# EasyEDA Pro project CCD传感器驱动板_DAC8311_ADS1118.eprj, board PCB1
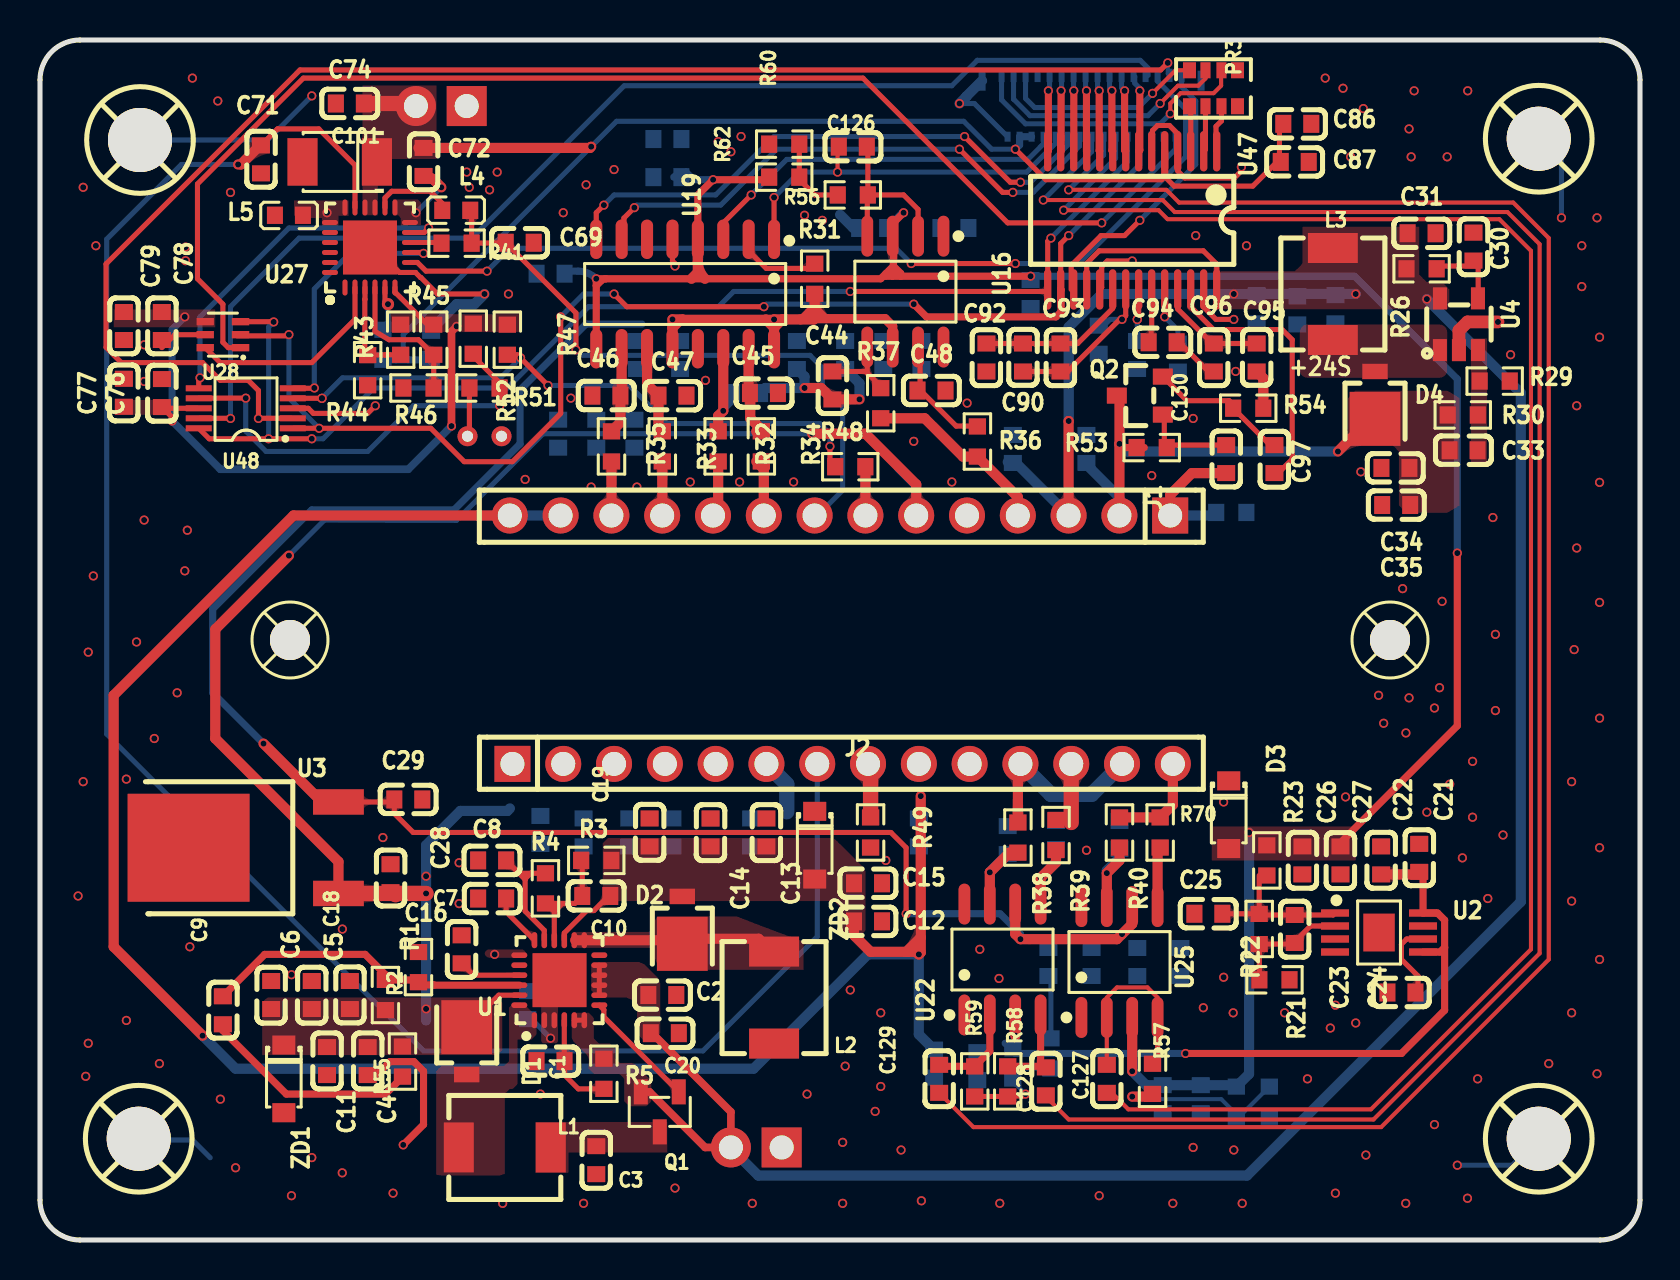
[diagram p2: board, top side]
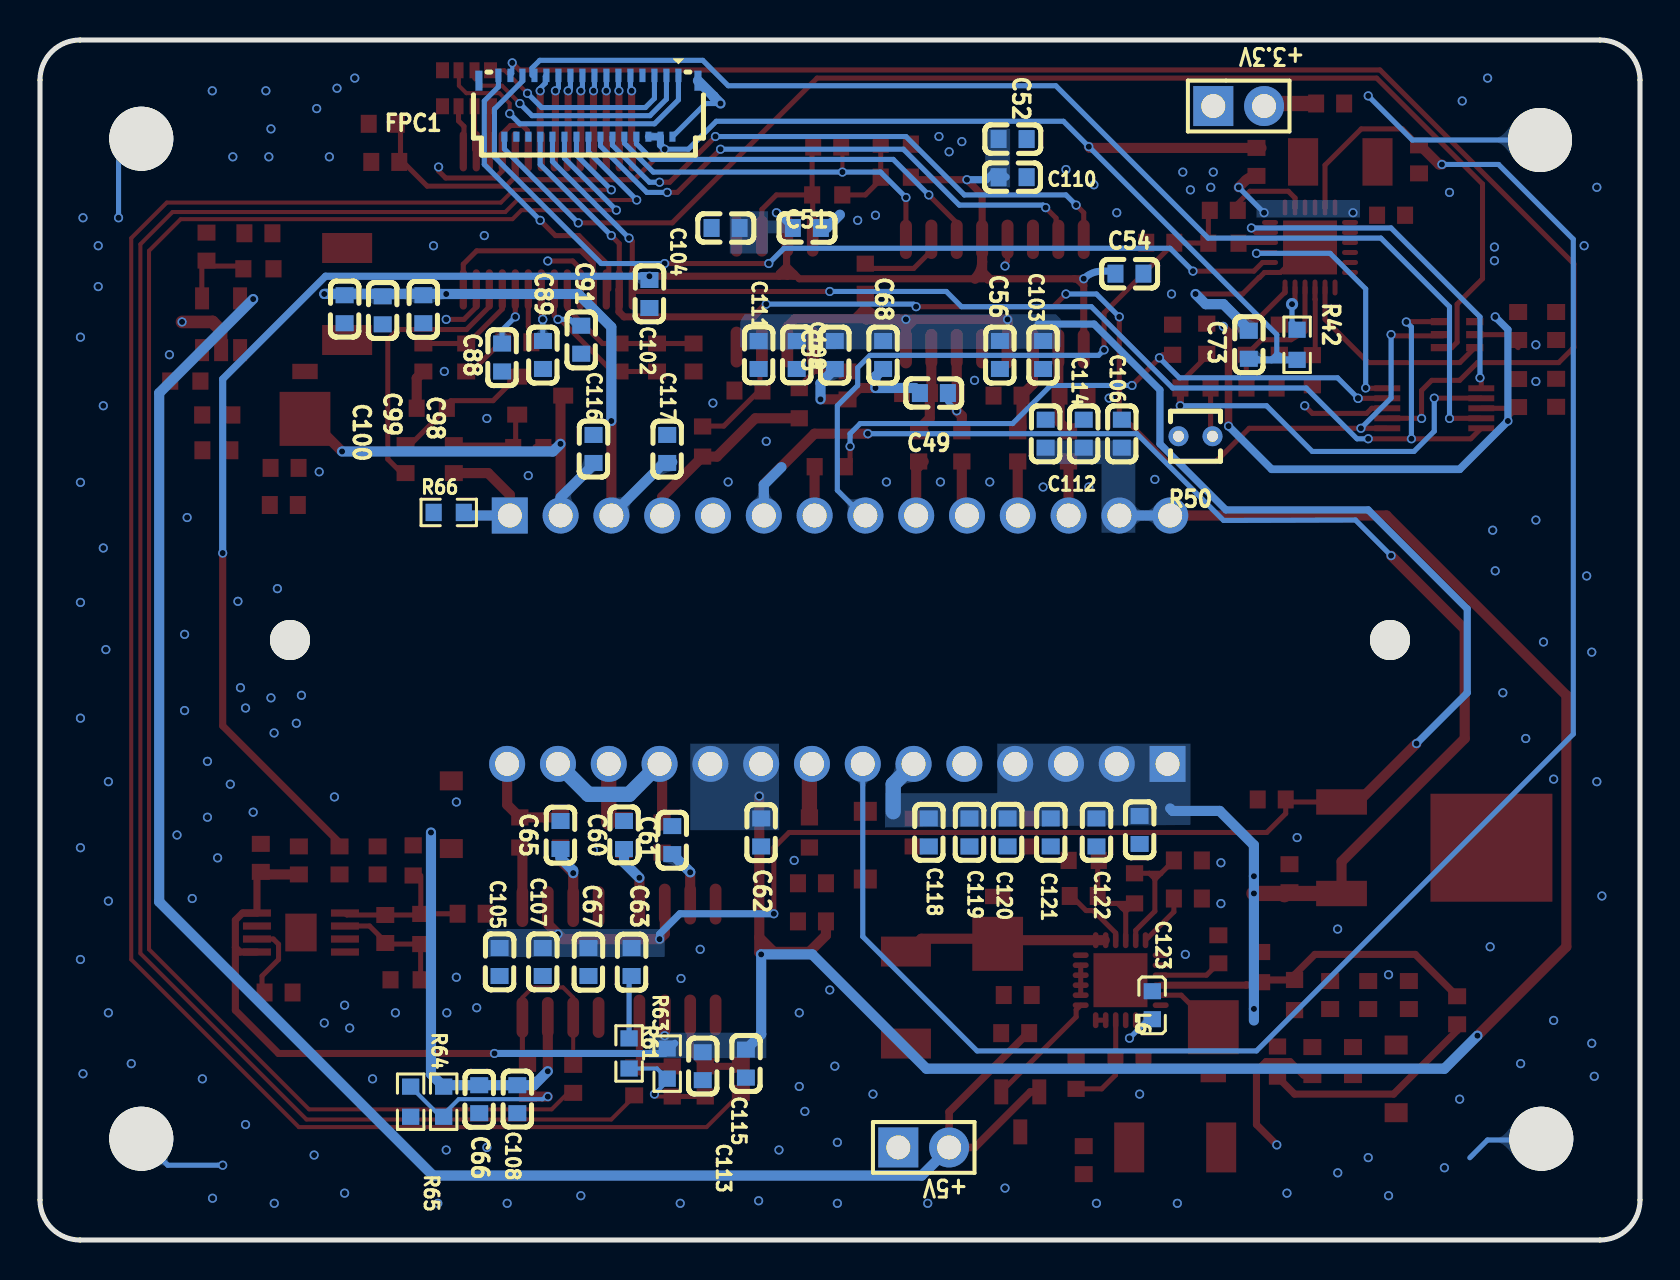
[diagram p3: board, bottom side, seen from below]

Outline 80 x 60 mm; copper layers: Top Layer, Inner1, Inner2, Bottom Layer. Coordinates in mm from the lower left corner of the outline.
Outline path: 0,58 0,2 arc(0.59,0.59) 2,0 78,0 arc(79.41,0.59) 80,2 80,58 arc(79.41,59.41) 78,60 2,60 arc(0.59,59.41) 0,58
Stack: Top Layer 0.035mm 外层铜厚1oz / Dielectric1 0.2104mm 7628 RC49% 8.6mil / Inner1 0.0152mm 内层铜厚 / Dielectric2 1.065mm 1.1mm H/HOZ 含铜 / Inner2 0.0152mm 内层铜厚 / Dielectric3 0.2104mm 7628 RC49% 8.6mil / Bottom Layer 0.035mm 外层铜厚1oz

## Design rules (mm)
template: 自定义配置
spacing copperThickness1oz (default): track to track 0.152, other pairs 0.152 to 0.3
spacing copperThickness2oz: track to track 0.203, other pairs 0.152 to 0.3
track width copperThickness1oz (default): min 0.127, default 0.254, max 2.54
track width copperThickness2oz: min 0.203, default 0.254, max 2.54
differential pair differentialPair (default): width min 0.127, default 0.254, max 2.54; gap min 0.152, default 0.152
via viaSize (default): diameter min 0.457, default 0.457, max 10; hole min 0.3, default 0.305, max 6.299

## Placement (name value [footprint] x y rotation side)
C1  100nF  [C0603]  25.53 8.95 180 top
C2  4.7uF  [C0603]  31.12 12.25 180 top
C3  4.7uF  [C0603]  27.81 3.99 90 top
C4  4.7uF  [C0603]  16.38 8.95 270 top
C5  4.7uF  [C0603]  13.59 12.25 90 top
C6  4.7uF  [C0603]  11.56 12.25 90 top
C7  4.7nF  [C0603]  22.61 17.07 180 top
C8  220nF  [C0603]  22.61 18.98 0 top
C9  15pF  [C0603]  9.14 11.49 270 top
C10  22pF  [C0603]  27.81 17.2 0 top
C11  4.7uF  [C0603]  14.35 8.95 270 top
C12  4.7uF  [C0603]  41.4 15.93 0 top
C13  4.7uF  [C0603]  36.32 20.38 90 top
C14  4.7uF  [C0603]  33.53 20.38 90 top
C15  4.7uF  [C0603]  41.4 17.84 0 top
C16  10nF  [C0603]  21.08 14.53 90 top
C18  100nF  [C0603]  15.49 12.25 270 top
C19  100nF  [C0603]  30.48 20.38 270 top
C20  100nF  [C0603]  31.24 10.34 180 top
C21  10uF  [C0603]  68.96 19.11 270 top
C22  100nF  [C0603]  67.06 18.98 270 top
C23  10nF  [C0603]  62.74 15.55 90 top
C24  10nF  [C0603]  68.07 12.38 0 top
C25  10uF  [C0603]  58.42 16.31 0 top
C26  4.7uF  [C0603]  63.12 18.98 270 top
C27  100nF  [C0603]  65.02 18.98 90 top
C28  330nF  [C0603]  17.53 18.09 270 top
C29  100nF  [C0603]  18.41 22.03 0 top
C30  220nF  [C0603]  71.68 49.67 90 top
C31  4.7uF  [C0603]  69.08 50.34 180 top
C33  10pF  [C0603]  71.18 39.49 0 top
C34  22uF  [C0603]  67.77 38.6 0 top
C35  10nF  [C0603]  67.81 36.75 180 top
C44  1nF  [C0603]  39.62 42.73 90 top
C45  1nF  [C0603]  36.19 42.35 180 top
C46  1nF  [C0603]  28.32 42.22 0 top
C47  1nF  [C0603]  31.62 42.22 180 top
C48  1nF  [C0603]  44.58 42.47 0 top
C49  1nF  [C0603]  35.31 42.35 180 bottom
C51  100nF  [C0603]  41.66 50.6 0 bottom
C52  100nF  [C0603]  31.37 55.05 0 bottom
C54  100nF  [C0603]  25.53 48.32 0 bottom
C55  100nF  [C0603]  40.26 44.25 90 bottom
C56  100nF  [C0603]  32 44.25 90 bottom
C60  1nF  [C0603]  50.8 20.25 270 bottom
C61  1nF  [C0603]  48.39 20 90 bottom
C62  100nF  [C0603]  43.94 20.38 90 bottom
C63  100nF  [C0603]  50.42 13.9 90 bottom
C65  1nF  [C0603]  53.97 20.25 90 bottom
C66  100nF  [C0603]  58.04 7.04 90 bottom
C67  100nF  [C0603]  52.58 13.9 90 bottom
C68  100nF  [C0603]  37.85 44.25 90 bottom
C69  10uF  [C0603]  23.99 49.86 0 top
C71  100nF  [C0603]  11.05 54.03 270 top
C72  10uF  [C0603]  19.18 53.9 270 top
C73  100nF  [C0603]  19.56 44.76 270 bottom
C74  100nF  [C0603]  15.49 56.83 0 top
C76  100nF  [C0603]  6.1 42.35 90 top
C77  10uF  [C0603]  4.19 42.36 90 top
C78  100nF  [C0603]  6.09 45.7 270 top
C79  10uF  [C0603]  4.19 45.7 270 top
C86  100nF  [C0603]  62.87 55.81 180 top
C87  4.7uF  [C0603]  62.74 53.9 0 top
C88  100nF  [C0603]  56.9 44.12 90 bottom
C89  100nF  [C0603]  54.85 44.25 90 bottom
C90  100nF  [C0603]  49.15 44.12 270 top
C91  100nF  [C0603]  52.94 45.01 90 bottom
C92  100nF  [C0603]  47.32 44.12 90 top
C93  10uF  [C0603]  51.02 44.12 90 top
C94  100nF  [C0603]  56.13 44.89 180 top
C95  100nF  [C0603]  60.83 44.12 270 top
C96  100nF  [C0603]  58.69 44.12 90 top
C97  100nF  [C0603]  61.72 39.05 90 top
C98  100nF  [C0603]  60.83 46.54 90 bottom
C99  100nF  [C0603]  62.87 46.48 90 bottom
C100  4.7uF  [C0603]  64.77 46.54 270 bottom
C101  100uF  [CASE-B_3528]  14.99 53.9 180 top
C102  4.7uF  [C0603]  49.53 47.3 270 bottom
C103  4.7uF  [C0603]  29.84 44.25 90 bottom
C104  4.7uF  [C0603]  45.72 50.6 0 bottom
C105  4.7uF  [C0603]  57.02 13.9 270 bottom
C106  4.7uF  [C0603]  25.91 40.31 90 bottom
C107  4.7uF  [C0603]  54.86 13.9 270 bottom
C108  4.7uF  [C0603]  56.13 7.04 270 bottom
C109  4.7uF  [C0603]  42.16 44.25 270 bottom
C110  4.7uF  [C0603]  31.37 53.14 180 bottom
C111  4.7uF  [C0603]  44.07 44.25 270 bottom
C112  4.7uF  [C0603]  29.72 40.31 90 bottom
C113  4.7uF  [C0603]  46.86 8.69 270 bottom
C114  4.7uF  [C0603]  27.81 40.31 90 bottom
C115  4.7uF  [C0603]  44.7 8.82 270 bottom
C116  4.7uF  [C0603]  52.32 39.55 90 bottom
C117  4.7uF  [C0603]  48.64 39.55 90 bottom
C118  4.7uF  [C0603]  35.56 20.38 270 bottom
C119  4.7uF  [C0603]  33.53 20.38 270 bottom
C120  4.7uF  [C0603]  31.62 20.38 270 bottom
C121  4.7uF  [C0603]  29.46 20.38 270 bottom
C122  4.7uF  [C0603]  27.18 20.38 270 bottom
C123  4.7uF  [C0603]  25.02 20.5 270 bottom
C126  100nF  [C0603]  40.64 54.67 180 top
C127  100nF  [C0603]  53.34 8.06 270 top
C128  100nF  [C0603]  50.29 7.93 270 top
C129  100nF  [C0603]  44.96 8.06 270 top
C130  100nF  [C0603]  59.31 39.05 270 top
D1  MBRM120ET1G  [POWERMITE_L2.0-W1.9-LS3.8-RD]  21.34 9.45 270 top
D2  MBRM120ET1G  [POWERMITE_L2.0-W1.9-LS3.8-RD]  32.12 15.99 90 top
D3  MMSZ5232B-7-F  [SOD-123_L2.8-W1.8-LS3.7-RD]  59.44 21.27 270 top
D4  MBRM120ET1G  [POWERMITE_L2.0-W1.9-LS3.8-RD]  66.75 42.24 90 top
FPC1  HC-FPC-03-09-31RLTAG  [FPC-SMD_31P-P0.30_HC-FPC-03-09-31RLTAG]  52.58 56.7 180 bottom
H1  PZ254V-11-02P  [HDR-TH_2P-P2.54-V-M]  35.81 4.63 180 bottom
H7  PZ254V-11-02P  [HDR-TH_2P-P2.54-V-M]  20.07 56.7 180 bottom
J1  PM254-1-14-Z-3.0-C  [HDR-TH_14P-P2.54-V-F]  40 36.22 180 top
J2  PM254-1-14-Z-3.0-C  [HDR-TH_14P-P2.54-V-F]  40.13 23.81 0 top
L1  4.7uH  [IND-SMD_L5.5-W5.2]  23.24 4.63 180 top
L2  4.7uH  [IND-SMD_L5.5-W5.2]  36.7 12.12 270 top
L3  4.7uH  [IND-SMD_L5.5-W5.2]  64.64 47.3 90 top
L4  1uH  [L0603]  20.81 51.48 0 top
L5  BLM18PG121SN1D  [L0603]  12.45 51.24 180 top
L6  BLM18PG121SN1D  [L0603]  24.38 11.74 90 bottom
PR3  22Ω  [RES-ARRAY-SMD_0603-8P-L3.2-W1.6-BL]  58.67 57.59 180 top
Q1  SI2323DS-T1-E3-MS  [SOT-23-3_L2.9-W1.3-P1.90-LS2.4-BR]  30.99 6.41 90 top
Q2  PMBT3904,215  [SOT-23_L2.9-W1.3-P1.90-LS2.4-BR]  54.99 42.22 0 top
R1  442kΩ  [R0603]  17.27 12.25 270 top
R2  56kΩ  [R0603]  18.92 13.64 270 top
R3  330kΩ  [R0603]  27.81 18.98 0 top
R4  49.9kΩ  [R0603]  25.27 17.58 90 top
R5  100Ω  [R0603]  28.19 8.31 270 top
R21  100kΩ  [R0603]  61.72 13.01 180 top
R22  324kΩ  [R0603]  60.96 15.55 90 top
R23  0Ω  [R0603]  61.34 18.98 90 top
R26  10kΩ  [R0603]  69.08 48.56 0 top
R29  10kΩ  [R0603]  72.73 42.95 0 top
R30  180kΩ  [R0603]  71.14 41.25 0 top
R31  10kΩ  [R0603]  38.74 48.06 270 top
R32  0Ω  [R0603]  33.91 39.68 270 top
R33  0Ω  [R0603]  31.12 39.68 270 top
R34  0Ω  [R0603]  36.07 39.68 270 top
R35  0Ω  [R0603]  28.57 39.68 270 top
R36  0Ω  [R0603]  46.87 39.92 270 top
R37  0Ω  [R0603]  42.04 41.84 270 top
R38  0Ω  [R0603]  48.9 20.12 90 top
R39  0Ω  [R0603]  50.8 20.25 90 top
R40  0Ω  [R0603]  53.97 20.38 90 top
R41  10Ω  [R0603]  20.83 49.84 180 top
R42  10Ω  [R0603]  17.14 44.76 90 bottom
R43  6.65kΩ  [R0603]  18.03 45.01 270 top
R44  10kΩ  [R0603]  16.38 43.49 270 top
R45  90.9kΩ  [R0603]  19.69 45.01 270 top
R46  37.4kΩ  [R0603]  18.92 42.6 0 top
R47  49.9kΩ  [R0603]  23.37 45.01 90 top
R48  25.5kΩ  [R0603]  40.51 38.66 0 top
R49  0Ω  [R0603]  41.53 20.38 90 top
R50  MF52A103F3950 (A1)  [RES-TH_L2.5-W2.5-P1.70-D0.3]  22.22 40.19 0 bottom
R51  25.5kΩ  [R0603]  22.22 42.6 180 top
R52  49.9kΩ  [R0603]  21.66 45.06 90 top
R53  110kΩ  [R0603]  55.59 39.62 180 top
R54  4kΩ  [R0603]  60.41 41.59 180 top
R55  51.1kΩ  [R0603]  18.12 8.92 90 top
R56  10kΩ  [R0603]  40.64 52.25 0 top
R57  10kΩ  [R0603]  55.63 8.06 90 top
R58  10kΩ  [R0603]  48.39 7.93 90 top
R59  10kΩ  [R0603]  46.74 7.93 90 top
R60  49.9kΩ  [R0603]  37.21 54.79 180 top
R61  49.9kΩ  [R0603]  50.55 9.33 90 bottom
R62  10kΩ  [R0603]  37.21 53.14 0 top
R63  10kΩ  [R0603]  48.64 8.82 270 bottom
R64  10kΩ  [R0603]  59.82 6.91 90 bottom
R65  10kΩ  [R0603]  61.47 6.91 90 bottom
R66  100kΩ  [R0603]  59.56 36.38 180 bottom
R70  0Ω  [R0603]  56.01 20.38 270 top
SCREW1  -  [M2螺丝]  12.5 30 0 top
SCREW2  -  [M2螺丝]  67.5 30 0 top
SCREW3  -  [M3螺丝]  75 55 0 top
SCREW4  -  [M3螺丝]  5.06 54.94 0 top
SCREW5  -  [M3螺丝]  5 5 0 top
SCREW6  -  [M3螺丝]  75 5 0 top
U1  TPS65131RGER  [QFN-24_L4.0-W4.0-P0.50-TL-EP2.6]  25.97 12.99 90 top
U2  TPS7A3001DGNR  [HVSSOP-8_L3.0-W3.0-P0.65-LS4.9-BL-EP_1]  66.95 15.37 270 top
U3  78M06  [TO-252-3_L6.5-W5.8-P4.58-BL]  11.18 19.61 90 top
U4  LT1935ES5#TRPBF  [TSOT-23-5_L2.9-W1.6-P0.95-LS2.8-BR]  70.95 45.79 270 top
U16  EL7202CSZ-T7  [SOIC-8_L4.9-W3.9-P1.27-LS6.0-BL]  43.27 47.42 180 top
U19  EL7457CSZ  [SOIC-16_L9.9-W3.9-P1.27-LS6.0-BL]  32.26 47.3 180 top
U22  EL7202CSZ-T7  [SOIC-8_L4.9-W3.9-P1.27-LS6.0-BL]  48.13 14.02 0 top
U25  EL7202CSZ-T7  [SOIC-8_L4.9-W3.9-P1.27-LS6.0-BL]  53.97 13.9 0 top
U27  ADN8833ACPZ-R2  [LFCSP-24_L4.0-W4.0-P0.50-BL-EP2.7]  16.5 49.63 0 top
U28  DAC8311IDCKR  [SC-70-6_L2.0-W1.3-P0.65-LS2.2-BL]  9.14 45.27 90 top
U47  AD9826KRSZRL  [SSOP-28_L10.2-W5.3-P0.65-LS7.8-BL]  54.61 50.98 180 top
U48  ADS1118IDGSR  [VSSOP-10_L3.0-W3.0-P0.50-LS4.9-BL]  10.29 41.58 90 top
ZD1  BZT52C15  [SOD-123_L2.8-W1.8-LS3.7-RD]  12.19 8.06 270 top
ZD2  BZT52C15  [SOD-123_L2.8-W1.8-LS3.7-RD]  38.74 19.74 270 top

## Footprints (pads in the part's own frame, mm; a bottom-side part is the same pattern mirrored in y, then rotated)
C0603
  rect 0.8x0.9 smd: 1(-0.7,0) 2(0.7,0)
CASE-B_3528
  rect 1.506x2.376 smd: 1(-1.861,0) 2(1.861,0)
FPC-SMD_31P-P0.30_HC-FPC-03-09-31RLTAG
  rect 0.3x0.67 smd: 1(4.5,1.532) 3(3.9,1.532) 5(3.3,1.532) 7(2.7,1.532) 9(2.1,1.532) 11(1.5,1.532) 13(0.9,1.532) 15(0.3,1.532) 17(-0.3,1.532) 19(-0.9,1.532) 21(-1.5,1.532) 23(-2.1,1.532) 25(-2.7,1.532) 27(-3.3,1.532) 29(-3.9,1.532) 31(-4.5,1.532)
  rect 0.3x0.5 smd: 2(4.2,-1.532) 4(3.6,-1.532) 6(3,-1.532) 8(2.4,-1.532) 10(1.8,-1.532) 12(1.2,-1.532) 14(0.6,-1.532) 16(0,-1.532) 18(-0.6,-1.532) 20(-1.2,-1.532) 22(-1.8,-1.532) 24(-2.4,-1.532) 26(-3,-1.532) 28(-3.6,-1.532) 30(-4.2,-1.532)
  rect 0.35x1 smd: 32(-5.475,1.268) 33(5.475,1.268)
HDR-TH_2P-P2.54-V-M
  rect 2x2 hole 1.2: 1(-1.27,0)
  round 2 hole 1.2: 2(1.27,0)
HDR-TH_14P-P2.54-V-F
  rect 1.8x1.8 hole 1.2: 1(-16.51,0)
  round 1.8 hole 1.2: 2(-13.97,0) 3(-11.43,0) 4(-8.89,0) 5(-6.35,0) 6(-3.81,0) 7(-1.27,0) 8(1.27,0) 9(3.81,0) 10(6.35,0) 11(8.89,0) 12(11.43,0) 13(13.97,0) 14(16.51,0)
HVSSOP-8_L3.0-W3.0-P0.65-LS4.9-BL-EP_1
  rect 0.364x1.4 smd: 1(-0.975,-2.2) 2(-0.325,-2.2) 3(0.325,-2.2) 4(0.975,-2.2) 5(0.975,2.2) 6(0.325,2.2) 7(-0.325,2.2) 8(-0.975,2.2)
  rect 1.89x1.57 smd: 9(0,0)
IND-SMD_L5.5-W5.2
  rect 1.5x2.5 smd: 1(-2.3,0) 2(2.3,0)
L0603
  rect 0.8x0.864 smd: 1(-0.7,0) 2(0.7,0)
LFCSP-24_L4.0-W4.0-P0.50-BL-EP2.7
  oval 0.25x0.8 smd: 1(-1.25,-2) 2(-0.75,-2) 3(-0.25,-2) 4(0.25,-2) 5(0.75,-2) 6(1.25,-2) 13(1.25,2) 14(0.75,2) 15(0.25,2) 16(-0.25,2) 17(-0.75,2) 18(-1.25,2)
  oval 0.8x0.25 smd: 7(2,-1.25) 8(2,-0.75) 9(2,-0.25) 10(2,0.25) 11(2,0.75) 12(2,1.25) 19(-2,1.25) 20(-2,0.75) 21(-2,0.25) 22(-2,-0.25) 23(-2,-0.75) 24(-2,-1.25)
  rect 2.7x2.7 smd: 25(0,0)
M2螺丝
  round 2 hole 2: 1(0,0)
M3螺丝
  round 3.2 hole 3.2: 1(-0.064,0.064)
POWERMITE_L2.0-W1.9-LS3.8-RD
  rect 2.7x2.54 smd: 1(-1.185,-0.001)
  rect 0.77x1.27 smd: 2(1.185,0.001)
QFN-24_L4.0-W4.0-P0.50-TL-EP2.6
  oval 0.8x0.28 smd: 1(-2,1.25) 2(-2,0.75) 3(-2,0.25) 4(-2,-0.25) 5(-2,-0.75) 6(-2,-1.25) 13(2,-1.25) 14(2,-0.75) 15(2,-0.25) 16(2,0.25) 17(2,0.75) 18(2,1.242)
  oval 0.28x0.8 smd: 7(-1.25,-2) 8(-0.75,-2) 9(-0.25,-2) 10(0.25,-2) 11(0.75,-2) 12(1.25,-2) 19(1.25,2) 20(0.75,2) 21(0.25,2) 22(-0.25,2) 23(-0.75,2) 24(-1.25,2)
  rect 2.7x2.7 smd: 25(0,-0.013)
R0603
  rect 0.806x0.864 smd: 1(-0.753,0) 2(0.753,0)
RES-ARRAY-SMD_0603-8P-L3.2-W1.6-BL
  rect 0.65x0.8 smd: 1(-1.2,-0.9) 4(1.2,-0.9) 5(1.2,0.9) 8(-1.2,0.9)
  rect 0.5x0.8 smd: 2(-0.4,-0.9) 3(0.4,-0.9) 6(0.4,0.9) 7(-0.4,0.9)
RES-TH_L2.5-W2.5-P1.70-D0.3
  round 1 hole 0.55: 1(-0.85,0) 2(0.85,0)
SC-70-6_L2.0-W1.3-P0.65-LS2.2-BL
  rect 0.364x0.866 smd: 1(-0.65,-0.883) 2(0,-0.883) 3(0.65,-0.883) 4(0.65,0.883) 5(0,0.883) 6(-0.65,0.883)
SOD-123_L2.8-W1.8-LS3.7-RD
  rect 0.95x1.15 smd: 1(-1.692,0) 2(1.692,0)
SOIC-8_L4.9-W3.9-P1.27-LS6.0-BL
  oval 0.588x2.045 smd: 1(-1.905,-2.772) 2(-0.635,-2.772) 3(0.635,-2.772) 4(1.905,-2.772) 5(1.905,2.772) 6(0.635,2.772) 7(-0.635,2.772) 8(-1.905,2.772)
SOIC-16_L9.9-W3.9-P1.27-LS6.0-BL
  oval 0.602x1.971 smd: 1(-4.445,-2.736) 2(-3.175,-2.736) 3(-1.905,-2.736) 4(-0.635,-2.736) 5(0.635,-2.736) 6(1.905,-2.736) 7(3.175,-2.736) 8(4.445,-2.736) 9(4.445,2.736) 10(3.175,2.736) 11(1.905,2.736) 12(0.635,2.736) 13(-0.635,2.736) 14(-1.905,2.736) 15(-3.175,2.736) 16(-4.445,2.736)
SOT-23-3_L2.9-W1.3-P1.90-LS2.4-BR
  rect 1.25x0.7 smd: 1(1,-0.95) 2(1,0.95) 3(-1,0)
SOT-23_L2.9-W1.3-P1.90-LS2.4-BR
  rect 1x0.8 smd: 1(1.15,-0.95) 2(1.15,0.95) 3(-1.15,0)
SSOP-28_L10.2-W5.3-P0.65-LS7.8-BL
  oval 0.364x2.015 smd: 1(-4.225,-3.455) 2(-3.575,-3.455) 3(-2.925,-3.455) 4(-2.275,-3.455) 5(-1.625,-3.455) 6(-0.975,-3.455) 7(-0.325,-3.455) 8(0.325,-3.455) 9(0.975,-3.455) 10(1.625,-3.455) 11(2.275,-3.455) 12(2.925,-3.455) 13(3.575,-3.455) 14(4.225,-3.455) 15(4.225,3.455) 16(3.575,3.455) 17(2.925,3.455) 18(2.275,3.455) 19(1.625,3.455) 20(0.975,3.455) 21(0.325,3.455) 22(-0.325,3.455) 23(-0.975,3.455) 24(-1.625,3.455) 25(-2.275,3.455) 26(-2.925,3.455) 27(-3.575,3.455) 28(-4.225,3.455)
TO-252-3_L6.5-W5.8-P4.58-BL
  rect 1.27x2.54 smd: 1(-2.288,-3.747) 3(2.288,-3.745)
  rect 5.4x6.1 smd: 2(-0.002,3.747)
TSOT-23-5_L2.9-W1.6-P0.95-LS2.8-BR
  rect 1.1x0.7 smd: 1(1.294,-0.951) 2(1.294,-0.001) 3(1.294,0.951) 4(-1.294,0.951) 5(-1.294,-0.949)
VSSOP-10_L3.0-W3.0-P0.50-LS4.9-BL
  rect 0.3x1.3 smd: 1(-1,-2.35) 2(-0.5,-2.35) 3(0,-2.35) 4(0.5,-2.35) 5(1,-2.35) 6(1,2.35) 7(0.5,2.35) 8(0,2.35) 9(-0.5,2.35) 10(-1,2.35)

## Nets
As in the schematic.

Pads without a net: FPC1 7 26 28; PR3 1 8; U1 12 20; U2 3 7; U16 1 8; U19 6 13; U22 1 8; U25 1 8; U27 1 20 21 22 23 24

## Via types
v1: diameter 0.457, hole 0.305, Top Layer to Bottom Layer, 275 vias
v2: diameter 0.61, hole 0.305, Top Layer to Bottom Layer, 1 via

## Routing (per net, layer and track width the routed paths; a pad name or vN(x,y) marks a point on that pad's centre or on a via; arc(x,y) is an arc through that point)
+3.3V: length 69.3
  Top Layer w0.254: 61.97,55.49 61.97,54.03 60.64,52.69 56.71,52.69 56.24,53.17 56.08,53.02 50.29,53.02 v1(48.77,54.54)
  Top Layer w0.355: U47.5 56.24,53.17
  Top Layer w0.508: 18.92,54.6 27.5,54.6 v1(27.56,54.67)
  Top Layer w0.762: 18.8,57.08 18.54,56.83 C74.2
  Bottom Layer w0.254: 18.16,44.26 18.16,45.27 v1(27.56,54.67) 28.83,55.94 46.18,55.94 47.58,54.54 v1(48.77,54.54)
  Bottom Layer w0.305: 18.41,44.01 18.16,44.26 arc(18.05,44.24) 17.95,44.17 17.79,44.01
  Bottom Layer w0.355: v1(48.77,54.54) 48.98,54.75 FPC1.4 FPC1.6 ; 19.18,44.06 19.18,44.01 17.4,44.01
+5V: length 131.6
  Top Layer w0.254: U47.18 52.34,48.83 52.96,49.46 58.17,49.46 58.84,48.79 U47.28 ; U1.8 U1.9 U1.10 U1.11 ; U1.6 U1.5
  Top Layer w0.381: 30.35,10.5 30.45,10.5 34.54,6.41 H1.2 33.26,4.63 30.48,7.41 Q1.2
  Top Layer w0.508: J1.3 51.43,40.94 v1(51.44,40.95)
  Bottom Layer w0.508: J1.3 48.76,38.9 48.39,38.9 ; v1(69.34,47.05) 74.04,42.35 74.04,16.91 60.35,3.22 35.92,3.22 34.38,4.75 34.42,4.75 ; v1(65.79,47.3) 65.78,47.31 60.46,47.31 60.46,47.3 v1(59.69,47.3) 53.09,47.3 51.44,45.65 v1(51.44,40.95)
+6V_D: length 109.7
  Top Layer w0.254: v1(43.31,16.31) 43.31,19.61 42.54,20.38 18.66,20.38 17.72,21.32 17.72,21.9 14.92,21.9 U3.3
  Top Layer w0.355: 39.32,46.07 38.93,46.46 arc(38.84,46.52) 38.74,46.54 arc(38.57,46.51) 38.42,46.41 38.04,46.03
  Top Layer w0.457: 32.12,46.03 v1(36.7,46.03) ; U16.6 42.63,45.69 42.25,46.07 38.74,46.07
  Top Layer w0.508: 31.62,45.61 U19.12 ; 31.62,45.61 31.98,45.97 arc(32.05,46.02) 32.12,46.03 v1(31.62,46.03) 31.62,45.61 ; 36.7,45.62 36.29,46.03 ; 36.7,45.62 37.11,46.03 ; 36.7,45.62 v1(36.7,46.03) 37.11,46.03 ; 36.7,45.62 U19.16 ; U22.6 48.76,15.3 v1(49.02,15.04) 53.85,15.04 v1(54.1,15.3) 54.61,15.8 54.61,16.8 ; R31.2 38.74,46.07 38.7,46.03 37.11,46.03 ; U3.3 14.09,21.9 v1(11.18,24.82)
  Bottom Layer w0.355: v1(11.18,24.82) 8.64,27.36 8.64,31.55 13.59,36.5 20.7,36.5 24,39.81 24,42.5 27.3,45.8 30.1,45.8 ; v1(49.02,15.04) 49.02,15.3 48.01,16.31 v1(43.31,16.31)
+12V_D: length 84.5
  Top Layer w0.254: U1.23 22.94,12.24 D1.1
  Top Layer w0.508: U3.1 14.92,18.92 8.76,25.08 8.76,30.54 v1(12.45,34.22) ; J1.6 43.81,37.78 41.28,40.31 v1(38.61,40.31)
  Top Layer w0.762: U3.1 17.84,17.33 17.78,17.26 ; v1(19.3,17.33) 17.84,17.33
  Bottom Layer w0.254: v1(12.45,34.22) 14.22,36 20.82,35.98 25.16,40.31 v1(38.61,40.31)
  Bottom Layer w0.508: 42.93,38.64 43.81,37.76 J1.6 ; 23.5,21.58 23.37,21.45 21.02,21.45 19.3,19.74 v1(19.3,18.19) v1(19.3,17.33) v1(19.3,11.56) 19.3,10.98
  Bottom Layer w0.762: 37.34,21.41 37.34,22.79 J2.6
+24V_D: length 24.8
  Top Layer w0.355: 55.21,39.62 54.16,39.62 v1(53.97,39.81)
  Top Layer w0.508: v1(64.9,39.43) 66.75,41.28 66.75,41.82 ; J1.2 53.97,39.8 v1(53.97,39.81) 53.97,42.09 Q2.3
  Bottom Layer w0.508: J1.2 53.97,37.12 52.32,38.77 ; v1(53.97,39.81) 54.36,39.43 v1(64.9,39.43)
-5V_D: length 115.5
  Top Layer w0.355: 42.29,48.32 42.29,48.19 42.63,48.19 ; 42.29,48.32 42.04,48.06 28.29,48.06 ; 42.29,48.32 42.67,48.7 ; 42.67,48.7 43.03,48.33 43.03,48.19 ; 42.67,48.7 42.67,50.15 U16.3 42.63,50.82 v1(43.18,51.36) ; 42.67,48.7 42.67,48.23 42.63,48.19 ; 43.03,48.19 42.63,48.19 ; 43.03,48.19 v1(49.53,48.19) ; v1(70.87,34.35) 70.87,25.71 64.84,19.68 64.77,19.68 ; 27.81,47.72 v1(27.81,48.06) 28.29,48.06 ; 27.81,47.72 27.81,44.56 ; 27.81,47.72 28.06,47.97 arc(28.17,48.04) 28.29,48.06 ; R62.1 36.33,53.02 v1(33.66,53.02) 32.89,52.25 U19.4
  Top Layer w0.508: 32.58,48.06 32.89,48.38 32.89,48.92 ; v1(54.61,8.44) U25.3 ; 32.89,48.92 U19.4 ; 32.89,48.92 arc(32.99,48.45) 33.25,48.06
  Bottom Layer w0.355: v1(70.87,34.35) 70.87,43.05 65.72,48.19 v1(49.53,48.19) ; v1(33.66,53.02) 32.68,53.02 32.3,53.4 arc(31.97,53.33) 31.69,53.14 ; C51.2 43.12,51.36 v1(43.18,51.36) ; 26.23,48.44 26.89,48.44 arc(27.39,48.34) v1(27.81,48.06)
  Bottom Layer w0.508: v1(60.45,20.38) 60.45,8.3 R64.2 59.74,7.74 C66.2 C108.1 55.31,7.74 v1(54.61,8.44)
-8V_D: length 140.6
  Top Layer w0.254: U1.15 26.22,15.35 27.34,16.47 27.7,16.47 28.43,17.2 C10.2
  Top Layer w0.355: 69.09,18.28 69.15,18.22 U2.8 69.88,16.35 70.23,15.99 70.23,14.63 ; v1(57.28,9.33) 68.07,9.33 70.23,11.49 70.23,14.63 ; 70.23,14.63 70,14.4 U2.5
  Top Layer w0.508: v1(8.13,10.22) 3.68,14.66 3.68,27.23 12.67,36.22 J1.14 ; U22.3 48.77,11.24 v1(48.77,10.22) ; 69.09,18.28 C22.2 ; 43.33,14.41 41.53,14.41 40.7,15.23 C12.1 ; 43.33,14.41 43.33,14.42 44.04,15.13 ; 43.33,14.41 43.81,14.41 v1(43.94,14.28) 44.04,14.38 44.04,15.13 ; 44.04,15.13 v1(44.04,22.19)
  Bottom Layer w0.355: v1(57.28,9.33) 48.77,9.33 48.26,9.84
  Bottom Layer w0.508: v1(8.13,10.22) 9.78,8.56 35.68,8.56 41.39,14.28 v1(43.94,14.28) 43.94,10.28 44.7,9.52 ; J1.14 J1.13
  vias: v1(23.16,36)
AGND: length 86.1
  Top Layer w0.254: 6.09,44.62 6.74,45.27 8.26,45.27 ; U47.6 55.63,54.48 55.63,55.47 55.88,55.73 56.47,55.73 56.88,55.31 56.88,53.46 57.24,53.1 59.72,53.1 60.07,53.46 v1(60.07,53.65) ; 31.75,48.82 31.62,48.95 U19.5 ; v1(59.69,46.03) 58.8,46.03 58.19,46.65 U47.27 ; v1(54.61,48.95) 53.37,48.95 53.09,48.67 53.09,47.63 U47.19 ; v1(22.22,47.3) 19.87,47.3 19.05,48.12 19.03,48.12 18.77,48.38 U27.7 17.97,48.38 16.72,49.63 U27.25 ; C96.1 58.42,43.42 56.96,44.89 ; U48.3 13.41,41.58 13.67,41.33 16.38,41.33 v1(16.76,41.71)
  Top Layer w0.355: v1(18.16,4.75) 19.18,5.77 19.18,8.44 18.7,8.92 17.5,8.92 16.83,8.25 C4.2
  Top Layer w0.508: v1(40.97,42.03) 39.63,42.03 C44.1 39.05,42.6 v1(38.23,42.6) ; C95.2 61.16,43.09 61.16,41.59
  Top Layer w0.635: 70.95,44.75 70.95,45.47 71.37,45.9 v1(72.9,45.9)
  Bottom Layer w0.254: v1(5,5) 7.62,5 8.51,4.11 ; C63.1 50.55,13.07 R61.2 ; v1(70.87,3.74) 73.61,3.74 SCREW6.1 ; v1(13.59,57.21) 11.38,55 SCREW4.1 ; v1(45.97,56.83) 46.72,56.83 FPC1.2 ; v1(76.07,51.11) 76.07,53.93 SCREW3.1
  Bottom Layer w0.508: v1(45.97,56.83) 46.32,57.17 46.32,57.18 FPC1.33 ; v1(22.22,47.3) 21.72,46.79 20.83,46.79 19.56,45.52 C73.1 ; v1(40.97,42.03) 40.97,42.84 C55.1 ; C51.1 40.67,50.6 40,51.27 ; C68.1 38.23,43.17 v1(38.23,42.6) 36.26,42.6 C49.1
  vias: v1(1.91,17.2) v1(2.16,52.63) v1(2.16,22.92) v1(2.29,8.18) v1(2.41,29.39) v1(2.41,9.84) v1(2.67,33.2) v1(2.79,49.71) v1(4.32,23.04) v1(4.32,10.98) v1(4.83,29.9) v1(5.21,44.76) v1(5.21,42.93) v1(5.21,36) v1(5.72,25.08) v1(5.97,8.82) v1(6.86,27.36) v1(7.24,33.46) v1(7.28,49.65) v1(7.28,48.96) v1(7.37,35.49) v1(7.49,14.66) v1(7.62,58.09) v1(8.89,56.95) v1(9.02,7.04) v1(9.53,52.38) v1(9.78,3.61) v1(12.57,13.26) v1(12.57,2.22) v1(13.59,4.12) v1(15.12,15.55) v1(15.11,3.36) v1(17.14,20.12) v1(17.65,2.34) v1(20.96,18.86) v1(20.96,16.82) v1(21.34,53.4) v1(21.46,52.63) v1(22.48,52.51) v1(22.73,14.28) v1(22.86,53.4) v1(23.13,1.83) v1(23.42,47.3) v1(24.26,38.03) v1(25.02,7.29) v1(26.16,51.36) v1(26.54,42.09) v1(27.18,1.83) v1(27.31,52.76) v1(27.56,37.65) v1(28.7,53.52) v1(29.84,37.65) v1(31.75,48.7) v1(31.75,2.6) v1(32.51,37.9) v1(33.27,42.98) v1(33.91,54.92) v1(34.54,54.41) v1(34.98,37.9) v1(35.05,55.17) v1(35.61,1.83) v1(37.68,37.9) v1(38.23,51.24) v1(38.35,7.29) v1(39.12,50.98) v1(40.13,4.88) v1(40.13,1.83) v1(40.26,8.69) v1(40.51,12.5) v1(41.76,6.43) v1(42.04,11.36) v1(42.04,7.68) v1(42.29,18.98) v1(43.05,4.5) v1(43.69,39.93) v1(44.07,1.96) v1(45.59,37.9) v1(46.35,41.85) v1(46.99,14.53) v1(47.95,13.08) v1(47.99,1.83) v1(52.32,19.49) v1(52.96,2.22) v1(55.59,38.22) v1(56.64,1.83) v1(57.66,41.08) v1(57.66,4.63) v1(57.78,50.22) v1(58.17,11.61) v1(59.18,21.9) v1(59.18,13.14) v1(59.66,11.36) v1(59.69,4.5) v1(59.78,43.43) v1(60.11,1.83) v1(60.32,49.71) v1(62.23,11.36) v1(63.37,8.06) v1(64.26,58.09) v1(64.52,10.6) v1(64.77,11.74) v1(64.77,2.34) v1(65.15,57.59) v1(65.28,22.15) v1(65.53,54.16) v1(65.79,10.85) v1(66.04,38.41) v1(66.17,56.57) v1(66.29,4.25) v1(66.93,27.23) v1(67.18,25.84) v1(68.13,32.57) v1(68.3,25.35) v1(68.29,1.83) v1(68.45,55.56) v1(68.45,27.11) v1(68.56,54.16) v1(68.71,57.46) v1(69.34,21.39) v1(69.72,26.6) v1(69.72,5.77) v1(69.98,27.61) v1(70.1,31.93) v1(70.36,54.16) v1(70.49,22.79) v1(71.12,19.11) v1(71.39,57.46) v1(71.37,2.09) v1(71.63,23.93) v1(71.63,21.14) v1(71.88,8.06) v1(72.39,17.07) v1(72.64,36.12) v1(72.77,30.28) v1(72.77,26.47) v1(73.15,20.25) v1(73.53,44.27) v1(75.44,8.82) v1(76.58,22.92) v1(76.58,16.95) v1(76.58,11.36) v1(76.71,29.52) v1(76.84,41.71) v1(76.84,34.6) v1(77.09,49.71) v1(77.09,47.67) v1(77.85,51.11) v1(77.85,8.31) v1(77.98,45.14) v1(77.98,37.88) v1(77.98,31.88) v1(77.98,26.09) v1(77.98,19.61) v1(77.98,14.03)
GND: length 4.7
  Top Layer w0.508: v1(20.07,52.63) 19.72,52.98 arc(19.47,53.15) C72.2
  Bottom Layer w0.254: v1(25.53,10.09) 24.58,11.04 24.13,11.04 ; v1(20.07,52.63) v1(18.8,51.36)
  vias: v1(14.35,51.36)
P1V: length 2.9
  Top Layer w0.762: 51.56,20.88 J2.12
P2V: length 9.3
  Top Layer w0.508: R38.2 48.9,23.68 J2.11
  Bottom Layer w0.762: J2.11 50.55,22.28 52.58,22.28 J2.13
AD_ADCCLK: length 2.3
  Top Layer w0.254: U47.3 57.53,56.63 PR3.5
AD_ADCCLK_I: length 10.3
  Top Layer w0.203: v1(55.63,57.33) 56.78,58.49 PR3.4
  Bottom Layer w0.254: v1(55.63,57.33) 54.91,56.62 49.73,56.62 49.28,57.08 FPC1.5
AD_CDSCLK1: length 2.4
  Top Layer w0.254: PR3.7 59.07,55.95 58.8,55.68 58.8,54.47 U47.1
AD_CDSCLK1_I: length 14.6
  Top Layer w0.203: v1(56.51,56.32) 56.51,56.83 57.03,57.34 58.68,57.34 59.06,57.71 59.06,58.47 PR3.2
  Bottom Layer w0.254: FPC1.1 48.08,57.01 49.28,55.81 56.01,55.81 v1(56.51,56.32)
AD_CDSCLK2: length 2.3
  Top Layer w0.254: PR3.6 58.27,54.53 U47.2
AD_CDSCLK2_I: length 12.3
  Top Layer w0.203: PR3.3 58.27,58.08 57.91,57.71 56.9,57.71 v1(56.01,56.83)
  Bottom Layer w0.254: v1(56.01,56.83) 55.4,56.22 49.5,56.22 48.68,57.04 FPC1.3
ADC0_CCD_TH: length 31.8
  Top Layer w0.254: R47.1 23.87,44.26 v1(25.4,42.73) ; U48.4 v1(14.1,42.08) ; R48.1 39.5,38.93 v1(39.5,39.68)
  Bottom Layer w0.254: v1(24.03,44.11) 23.03,43.11 15.12,43.11 v1(14.1,42.08) ; v1(39.5,39.68) 39.5,40.31 38.99,40.82 31.37,40.82 29.46,42.73 v1(25.4,42.73)
ADC1_VTEC: length 12.9
  Top Layer w0.254: v1(19.18,49.33) 19.13,49.38 U27.9 ; U48.5 13.7,42.58 v1(13.72,42.6)
  Bottom Layer w0.254: v1(13.72,42.6) 13.72,47.55 15.49,49.33 v1(19.18,49.33)
ADC2_ITEC: length 17.9
  Top Layer w0.254: v1(19.43,50.6) 19.2,50.38 U27.11 ; v1(8,43.11) 7.94,43.05 7.94,42.58
  Bottom Layer w0.254: v1(8,43.11) 8,46.16 12.45,50.6 v1(19.43,50.6)
ADC3_ENV: length 21.3
  Top Layer w0.254: 21.54,44.31 22.98,42.87 R51.1 ; v1(10.29,42.09) 7.94,42.09 7.94,42.08
  Top Layer w0.355: v1(22.99,41.71) 22.98,41.72 R51.1
  Bottom Layer w0.254: v1(10.29,42.09) 10.29,40.44 11.3,39.43 16.38,39.43 18.67,41.71 v1(22.99,41.71)
ADN8833_EN: length 46.6
  Top Layer w0.254: v1(48.77,48.82) v1(43.56,48.82) ; v1(22.35,48.44) 19.3,48.44 18.87,48.88 U27.8
  Bottom Layer w0.254: v1(22.35,48.44) 23.5,49.59 42.8,49.59 v1(43.56,48.82) ; FPC1.27 55.88,57.94 57.28,56.54 57.28,54.16 51.94,48.82 v1(48.77,48.82)
CAPB: length 8.3
  Top Layer w0.254: 53.63,47.78 53.63,46.58 51.88,44.83 C93.2 49.75,44.83 49.74,44.81 49.72,44.83 C90.1 C92.2
CAPT: length 8.9
  Top Layer w0.254: C90.2 C93.1 51.38,43.42 53.99,46.03 v1(54.1,46.03) 54.28,46.21 54.28,47.53
  Bottom Layer w0.254: C91.2 53.19,45.71 53.51,46.03 v1(54.1,46.03)
CCD_IN: length 14
  Top Layer w0.254: 57.53,47.78 57.53,46.66 58.67,45.52 62.1,45.52 62.61,45.01 62.61,39.04 61.82,38.25
CCD_P+: length 95.2
  Top Layer w0.254: U27.17 15.75,53.74 13.94,55.56 11.87,55.56 C71.1
  Top Layer w0.508: C71.1 11,54.73 10.05,53.78 v1(9.91,53.78)
  Bottom Layer w0.254: v1(9.91,53.78) 7.07,53.78 3.33,50.04 3.33,25.3 19.18,9.45 33.15,9.45 38.86,15.17 38.86,23.64
CCD_P-: length 30.9
  Top Layer w0.254: v1(26.8,44.51) 26.8,46.35 C69.1 R41.1 21.58,51.29 21.51,51.36
  Bottom Layer w0.254: v1(26.8,44.51) 27.07,44.23 38.5,44.23 39.12,43.62 39.12,42.73 40.13,41.71 40.13,37.48 39,36.35
CCD_TH1: length 2.2
  Top Layer w0.508: 41.27,38.41 J1.7
CCD_TH2: length 2.7
  Top Layer w0.762: J2.8 41.53,23.68 R49.2
CML: length 2.7
  Top Layer w0.254: U47.23 55.59,45.67 55.56,45.65 55.56,44.89
D0: length 3.8
  Top Layer w0.355: v1(50.42,57.46) 50.42,54.47 50.38,54.44
  Bottom Layer w0.254: FPC1.9 50.48,57.52 v1(50.42,57.46)
D1: length 3.8
  Top Layer w0.355: U47.13 51.05,54.46 v1(51.05,57.46)
  Bottom Layer w0.254: v1(51.05,57.46) 51.08,57.48 FPC1.11
D2: length 3.8
  Top Layer w0.355: v1(51.69,57.46) 51.69,54.44 U47.12
  Bottom Layer w0.254: FPC1.13 51.68,57.47 v1(51.69,57.46)
D3: length 3.8
  Top Layer w0.355: v1(52.32,57.46) 52.32,54.45 U47.11
  Bottom Layer w0.254: v1(52.32,57.46) 52.28,57.51 FPC1.15
D4: length 3.8
  Top Layer w0.355: U47.10 52.96,54.46 v1(52.96,57.46)
  Bottom Layer w0.254: FPC1.17 52.88,57.54 v1(52.96,57.46)
D5: length 3.9
  Top Layer w0.355: U47.9 53.59,54.48 v1(53.59,57.46)
  Bottom Layer w0.254: v1(53.59,57.46) 53.48,57.58 FPC1.19
D6: length 3.9
  Top Layer w0.355: v1(54.23,57.46) 54.23,54.49 54.28,54.44
  Bottom Layer w0.254: FPC1.21 54.08,57.61 v1(54.23,57.46)
D7: length 3.9
  Top Layer w0.355: v1(54.99,57.46) 54.99,54.49 U47.7
  Bottom Layer w0.254: v1(54.99,57.46) 54.99,57.59 54.74,57.84 54.74,58.17 FPC1.23
DAC0: length 10.3
  Top Layer w0.254: 8.26,44.62 9.01,43.87 13.59,43.87 15.75,46.03 U27.2
ILIM: length 7.2
  Top Layer w0.254: 19.68,44.26 18.92,45.01 17.45,45.01 16.75,45.43 U27.4 ; R45.2 19.69,42.61 R46.2
IP1H: length 28.6
  Top Layer w0.254: v1(28.19,51.75) 27.81,51.36 27.81,50.04 ; v1(46.23,55.17) 48.51,52.89 v1(49.02,52.89)
  Bottom Layer w0.254: v1(28.19,51.75) 28.7,52.25 33.78,52.25 36.7,55.17 v1(46.23,55.17) ; FPC1.12 51.38,54.74 49.53,52.89 v1(49.02,52.89)
IP1V: length 94.2
  Top Layer w0.203: 50.42,7.23 50.23,7.23 51.44,6.03 66.68,6.03 74.98,14.33 74.98,49.79 73.37,51.4 56.74,51.4 56.13,52 v1(50.16,52)
  Bottom Layer w0.254: v1(50.16,52) 52.58,54.41 FPC1.16
IP1V_8V: length 4.3
  Top Layer w0.355: 50.03,8.64 50.04,8.63 ; 50.03,8.64 49.98,8.68 R58.2 ; 50.03,8.64 U22.4
IP2H: length 27.3
  Top Layer w0.254: v1(29.72,51.62) 29.2,51.1 29.2,50.36 ; v1(48.64,52.38) 48.13,52.38 v1(45.97,54.54)
  Bottom Layer w0.254: v1(45.97,54.54) 36.83,54.54 34.04,51.75 29.84,51.75 v1(29.72,51.62) ; v1(48.64,52.38) 49.66,52.38 51.98,54.7 FPC1.14
IP2V: length 99.1
  Top Layer w0.203: C129.2 46.67,5.64 67.06,5.64 75.44,14.03 75.44,50.09 73.66,51.87 56.96,51.87 56.32,52.51 v1(51.44,52.51)
  Bottom Layer w0.254: v1(51.44,52.51) 53.18,54.25 FPC1.18
IP2V_8V: length 4.7
  Top Layer w0.355: U22.2 47.49,9.44 R59.2 45.01,8.68 44.96,8.63
IP3H: length 18.8
  Top Layer w0.254: U19.3 34.16,50.86 v1(35.56,52.25)
  Bottom Layer w0.254: v1(35.56,52.25) 37.34,54.03 49.4,54.03 50.18,54.81 FPC1.8
IP4H: length 18.9
  Top Layer w0.203: C126.2 39.94,54.35 39.88,54.29 v1(39.88,53.4)
  Top Layer w0.254: v1(36.7,52.13) U19.1
  Bottom Layer w0.254: v1(36.7,52.13) 37.97,53.4 v1(39.88,53.4) 49.33,53.4 50.78,54.84 FPC1.10
IP4H_5V: length 8.7
  Top Layer w0.254: R56.2 41.36,52.22 U16.4 ; R56.2 43.18,52.25 43.9,51.53 U16.2 ; R56.2 41.39,54.61 C126.1
IRG: length 88.5
  Top Layer w0.203: v1(51.18,51.49) 55.93,51.49 56.38,51.04 72.97,51.04 74.55,49.46 74.55,14.53 66.55,6.53 54.42,6.53 53.59,7.36
  Bottom Layer w0.254: FPC1.20 53.78,54.09 v1(51.18,51.49)
IRG_5V: length 9.7
  Top Layer w0.203: U25.4 55.88,12.12 55.37,12.63 53.85,12.63 53.34,12.12 U25.2 C127.1
  Top Layer w0.254: U25.4 55.88,9.06 R57.2
OFFSET: length 5.9
  Top Layer w0.254: C95.1 58.61,44.83 56.88,46.55 56.88,47.78
OS: length 6.6
  Top Layer w0.508: J1.1 56.51,37.26 57.59,38.34 C130.2
  Bottom Layer w0.508: J1.1 58.78,36.22 58.81,36.25
P1H: length 2.7
  Top Layer w0.508: J1.12 28.57,36.23 R35.2
P2H: length 2.7
  Top Layer w0.508: R33.2 31.12,36.23 J1.11
P3H: length 2.8
  Top Layer w0.508: J1.10 33.91,36.48 R32.2
P4H: length 2.9
  Top Layer w0.508: J1.9 36.19,38.55 35.81,38.93
RG: length 5
  Top Layer w0.508: R40.2 R70.1 56.64,21.76 J2.14
SG: length 9.4
  Top Layer w0.508: R37.2 44.24,41.09 46.15,39.17 R36.2 48.89,37.15 J1.4
SPI_AD9826_CS: length 14.3
  Top Layer w0.254: 51.56,47.53 51.56,48.72 53.06,50.22 54.23,50.22 v1(54.99,50.98)
  Bottom Layer w0.254: v1(54.99,50.98) 57.78,53.78 57.78,56.95 57.08,57.66 FPC1.31
SPI_ADC0_CS: length 73.7
  Top Layer w0.254: U48.2 10.93,41.08 v1(10.92,41.08) 10.92,42.47 10.41,42.98 9.02,42.98 8.13,43.87 4.06,43.87 3.3,44.63 3.3,48.8 13,58.5 56.03,58.5 v1(56.39,58.86)
  Bottom Layer w0.203: FPC1.29 56.39,58.32 v1(56.39,58.86)
SPI_CLK: length 64.4
  Top Layer w0.254: v1(12.45,45.27) 12.39,45.21 9.86,45.21 ; U47.16 51.03,49.82 v1(51.44,50.22) ; v1(36.19,46.67) 29.34,46.67 v1(28.7,47.3) ; U48.1 v1(13.96,40.58) 19.54,40.58 21.21,38.92 23.62,38.92 26.03,41.33 v1(26.03,46.16)
  Top Layer w0.355: v1(43.69,46.79) 44.32,46.16 50.8,46.16 51.05,46.41 51.05,47.51 U47.16
  Bottom Layer w0.254: v1(12.45,45.27) 12.45,42.09 v1(13.96,40.58) ; v1(36.19,46.67) 36.32,46.79 v1(43.69,46.79) ; v1(51.44,50.22) 54.99,53.78 54.99,55.15 FPC1.24 ; v1(28.7,47.3) 27.18,47.3 v1(26.03,46.16)
SPI_DAC_CS: length 65.7
  Top Layer w0.254: U28.1 9.41,44.62 9.14,44.89 9.14,46.79 7.87,48.06 7.87,52.8 13.17,58.09 41.15,58.09 48.39,50.86 v1(53.09,50.86)
  Bottom Layer w0.254: v1(53.09,50.86) 56.78,54.55 FPC1.30
SPI_MISO: length 58.8
  Top Layer w0.254: 7.94,41.08 9.52,41.08 v1(9.53,41.08)
  Bottom Layer w0.254: v1(9.53,41.08) 9.53,46.67 12.95,50.09 21.59,50.09 29.21,57.71 45.59,57.71 46.86,58.98 55.01,58.98 55.41,58.59 55.41,58.23 ; 55.28,58.1 FPC1.25
SPI_MOSI: length 62.7
  Top Layer w0.254: v1(40.51,47.43) 50.28,47.43 50.38,47.53 50.38,49.93 v1(50.55,50.09) ; v1(11.68,45.9) 11.67,45.92 U28.3 ; v1(13.59,40.06) v1(11.43,40.06) 8.46,40.06 7.94,40.58
  Bottom Layer w0.254: v1(11.68,45.9) 11.43,45.65 v1(11.43,40.06) ; v1(50.55,50.09) 54.38,53.93 FPC1.22 ; v1(13.59,40.06) 14.15,40.06 16.69,42.6 23.37,42.6 27.43,46.67 33.92,46.67 34.68,47.43 v1(40.51,47.43)
VLIM: length 5
  Top Layer w0.254: U27.3 16.25,47.04 16.24,47.03 16.24,44.51 16.49,44.25 17.26,44.25 17.27,44.26 R43.2
VREF_2.5V: length 32
  Top Layer w0.254: R45.1 19.38,45.77 17.75,47.4 U27.6 ; v1(6.6,40.95) 6.6,41.14 6.16,41.58 ; 6.16,41.58 6.1,41.65 ; 6.16,41.58 7.94,41.58
  Top Layer w0.381: v1(20.57,40.7) 20.57,45.42 v1(20.83,45.68)
  Bottom Layer w0.355: v1(7.24,46.16) 6.6,45.52 v1(6.6,40.95)
  Bottom Layer w0.381: v1(6.6,40.95) 9.02,38.54 18.41,38.54 v1(20.57,40.7)
$1N2699: length 5
  Top Layer w0.254: U1.4 26.22,8.96 26.23,8.95 26.23,8.25 26.92,7.56 R5.2
$1N3163: length 16.5
  Top Layer w0.355: U1.22 19.7,12.74 19.69,12.76 19.06,12.76 R2.2 18.81,13 R1.1 17.27,13.26 16.26,14.28 11.24,14.28 C9.1
$1N3544: length 10.1
  Top Layer w0.508: 36.58,14.42 35.93,15.06 31.99,15.06 31.92,14.99 U1.13 26.76,14.99
$1N3762: length 3.1
  Top Layer w0.254: C16.1 21.68,13.24 U1.21
$1N3934: length 2.7
  Top Layer w0.254: U1.18 23.31,16.41 C7.1
$1N5062: length 7.6
  Top Layer w0.254: U2.1 64.65,16.25 C23.2 61.01,16.25 R22.2 ; R22.2 60.96,18.23 ; R22.2 60.95,16.31 C25.2
$1N5080: length 6
  Top Layer w0.254: U2.2 63.52,15.7 62.74,14.92 C23.1 62.68,14.8 R22.1 60.97,14.79 R21.2
$1N5164: length 3.7
  Top Layer w0.254: 68.9,12.63 68.9,13.2 68.07,14.03 68.07,14.79 68.33,15.05 U2.6
$1N6498: length 3.6
  Top Layer w0.254: 71.91,47.34 71.91,48.69 71.9,48.7 69.68,48.7 69.68,48.69
$1N8780: length 3.2
  Top Layer w0.254: 56.24,47.78 v1(56.24,46.16)
  Bottom Layer w0.254: v1(56.24,46.16) 56.9,45.5 C88.2
$1N8816: length 2.6
  Top Layer w0.254: U47.22 54.94,46.1 v1(54.86,46.03)
  Bottom Layer w0.254: v1(54.86,46.03) 54.86,44.96 C89.2
$1N19938: length 6
  Top Layer w0.254: Q1.1 31.94,7.41 28.19,11.15 28.19,11.51 U1.7
$1N20623: length 6.5
  Top Layer w0.254: 24.53,18.34 23.97,18.34 23.96,18.33 ; 24.53,18.34 24.26,18.06 24.26,18.03 ; 24.53,18.34 R4.2 ; 23.96,18.33 C8.2 ; 23.96,18.33 24.26,18.03 ; 24.26,18.03 24.26,16.44 25.22,15.48 U1.17
$1N21010: length 7.2
  Top Layer w0.203: 25.91,16.58 25.91,16.65 25.73,16.83 25.73,16.4 ; 25.91,16.58 26.16,16.83 ; 25.91,16.58 25.73,16.4 ; 25.73,16.4 25.72,16.39 R4.1
  Top Layer w0.254: R3.1 27.11,18.93 C10.1 26.74,16.83 R4.1 ; U1.16 25.72,16.39
$1N25931: length 11
  Top Layer w0.355: C9.2 9.14,10.47 12.32,7.29 17.27,7.29 18.12,8.15 R55.1
$1N29689: length 4
  Top Layer w0.254: R60.1 37.96,53.02 38.74,52.25 R56.1
$1N29716: length 5.9
  Top Layer w0.203: R58.1 49.16,7.18 v1(49.28,7.29)
  Top Layer w0.254: R59.1 R58.1
  Bottom Layer w0.203: 48.51,8.06 49.27,7.3 49.4,7.3 ; R61.1 49.15,8.57 R63.2
$1N35262: length 9
  Top Layer w0.508: R57.1 55.49,7.17 v1(54.61,7.17)
  Bottom Layer w0.203: 54.61,7.29 54.86,7.04 59.06,7.04 59.82,6.29 ; R65.2 59.96,6.16 R64.1
$2N2065: length 5.8
  Top Layer w0.254: 46.87,40.8 46.76,40.7 45.81,40.7 44,42.5 44,44.55 U16.7
$2N2069: length 4.4
  Top Layer w0.254: U16.5 41.36,43.36 ; 41.36,43.36 41.29,43.43 39.37,43.43 ; 41.36,43.36 41.91,42.81 41.91,42.47
$2N2493: length 4.7
  Top Layer w0.508: U22.7 v1(47.49,18.38) 48.47,19.37 R38.1
  Bottom Layer w0.508: C61.1 47.49,18.4 v1(47.49,18.38)
$2N2979: length 4.4
  Top Layer w0.508: U19.11 30.35,42.79 C47.2 30.92,40.63 R33.1
$2N3219: length 4.4
  Top Layer w0.254: 38.77,48.8 38.54,48.58 36.31,48.58 35.43,49.46 35.43,50.04
$2N3340: length 5.3
  Top Layer w0.508: U19.14 v1(34.16,41.46) 33.91,41.2 R32.1
  Bottom Layer w0.254: v1(34.16,41.46) 34.61,41.9 C49.2
$2N3619: length 4.8
  Top Layer w0.508: 35.43,44.56 35.43,42.41 C45.2 35.51,42.33 35.51,41.09 36.17,40.43 35.81,40.43
$2N3658: length 4.2
  Top Layer w0.508: C46.2 29.08,42.28 U19.10 ; R35.1 29.02,40.88 29.02,42.09
$2N3941: length 4.8
  Top Layer w0.508: U22.5 v1(50.03,18.11) 50.8,18.88 R39.1
  Bottom Layer w0.508: v1(50.03,18.11) 50.8,18.88 C60.2
$2N4355: length 4.1
  Top Layer w0.254: U27.14 17.25,52.1 17.58,52.44 19.51,52.44 20.11,51.83 L4.1
$2N4879: length 2
  Top Layer w0.254: U27.5 17.25,46.94 v2(17.4,46.79)
  Bottom Layer w0.254: 17.27,45.77 17.4,45.89 v2(17.4,46.79)
$2N9003: length 6.9
  Top Layer w0.254: 56.14,43.17 57.34,41.97 59.46,41.97 59.65,41.77 ; C97.2 61.5,39.75 R54.2
$2N9069: length 4.8
  Top Layer w0.254: C130.1 56.22,39.75 56.22,41.19 56.14,41.27
  Top Layer w0.508: 56.22,39.75 R53.1
$2N35733: length 2.6
  Top Layer w0.254: 21.38,40.06 21.47,40.16 R51.2
$2N49859: length 2.9
  Top Layer w0.508: 56.01,19.5 55.88,19.37 U25.5
$2N49860: length 4.6
  Top Layer w0.508: 53.34,16.8 v1(53.34,18.34) 53.97,18.98 R40.1
  Bottom Layer w0.508: C65.1 53.97,19.11 53.34,18.47 v1(53.34,18.34)
$2N49964: length 1.6
  Top Layer w0.254: U27.10 20.04,49.88 R41.2

## Copper pours and planes (outline as drawn; the poured copper is in the pictures)
+3.3V on Top Layer: 16.13,57.73 19.83,57.73 19.83,51.24 16.13,51.24
+5V on Top Layer: 58.6,50.66 70.46,50.66 70.46,46.54 58.6,46.54
+5V on Top Layer: 27.56,13.9 31.01,13.9 31.01,9.94 27.56,9.94
+5V on Top Layer: 26.59,11.36 30.56,11.36 30.56,6.69 26.59,6.69
+6V_D on Bottom Layer: 28.96,46.28 44.99,46.28 44.99,44.51 28.96,44.51
+6V_D on Bottom Layer: 48.77,15.55 57.66,15.55 57.66,14.15 48.77,14.15
+12V_D on Top Layer: 11.11,12.12 23.11,12.12 23.11,9.25 11.11,9.25
+12V_D on Bottom Layer: 22.48,24.82 37.75,24.82 37.75,20.63 22.48,20.63
+12V_S2 on Top Layer: 8.99,12.59 15.74,12.59 15.74,7.93 8.99,7.93
+12V_S2 on Top Layer: 9.4,12.38 15.46,12.38 15.46,7.93 9.4,7.93
+24V_D on Top Layer: 65.4,42.46 70.98,42.46 70.98,36.36 65.4,36.36
-5V_D on Top Layer: 58.59,20.67 65.79,20.67 65.79,18.98 58.59,18.98
-5V_D on Bottom Layer: 31.5,55.56 32.75,55.56 32.75,52.63 31.5,52.63
-5V_D on Bottom Layer: 42.07,51.43 45.51,51.43 45.51,49.32 42.07,49.32
-8V_D on Top Layer: 28.14,20.1 41.28,20.1 41.28,15.23 28.14,15.23
-8V_D on Bottom Layer: 43.69,10.37 49.54,10.37 49.54,9.09 43.69,9.09
-8V_D on Bottom Layer: 25.23,39.97 30.18,39.97 30.18,35.36 25.23,35.36
-8V_D on Bottom Layer: 43.04,24.82 47.48,24.82 47.48,20.49 43.04,20.49
AGND on Top Layer: 0.13,60.76 83.29,60.76 83.29,-0.83 0.13,-0.83
AGND on Bottom Layer: -2.16,61.14 81.28,61.14 81.28,-1.21 -2.16,-1.21
AGND on Inner1: 1.15,58.85 78.85,58.85 78.85,1.15 1.15,1.15
AGND on Inner2: 1.15,58.85 78.85,58.85 78.85,1.15 1.15,1.15
GND on Top Layer: 17.65,52.03 19.05,52.03 19.05,50.72 17.65,50.72
GND on Top Layer: 12.7,51.98 15.42,51.98 15.42,50.72 12.7,50.72
GND on Top Layer: 25.06,14.31 25.9,14.31 25.9,9.84 25.06,9.84
GND on Bottom Layer: 14,52 19.18,52 19.18,51.12 14,51.12
VREF_2.5V on Top Layer: 17.52,46.29 24,46.29 24,45.39 17.52,45.39
VREF_2.5V on Top Layer: 3.68,46.52 8.76,46.52 8.76,45.63 3.68,45.63
VREF_2.5V on Top Layer: 3.74,42 6.55,42 6.55,41.27 3.74,41.27
$1N2998 on Top Layer: 19.81,11.87 24.82,11.87 24.82,3.23 19.81,3.23
$1N3544 on Top Layer: 26.72,16.19 38.18,16.19 38.18,13.51 26.72,13.51
$1N6777 on Top Layer: 62.99,45.78 70.36,45.78 70.36,43.11 62.99,43.11
$1N7221 on Top Layer: 71.55,45.08 72.35,45.08 72.35,38.87 71.55,38.87
$1N19808 on Top Layer: 24.76,5.9 31.36,5.9 31.36,3.36 24.76,3.36

Small or netless copper shapes (teardrops, artwork), in the pictures only: 160 on Top Layer, 54 on Bottom Layer, 34 on Inner1, 34 on Inner2

## Text on the board
Bottom Silkscreen Layer: +3.3V | +5V
Top Silkscreen Layer: +24S
